# Altium schematic sheet energy_meter_blk - Copy.SchDoc
size A4; Date: 1/11/16; Engineer: JBayalas; DocumentNumber: 5; Revision: V5.0.0; SheetNumber: 5; SheetTotal: 13
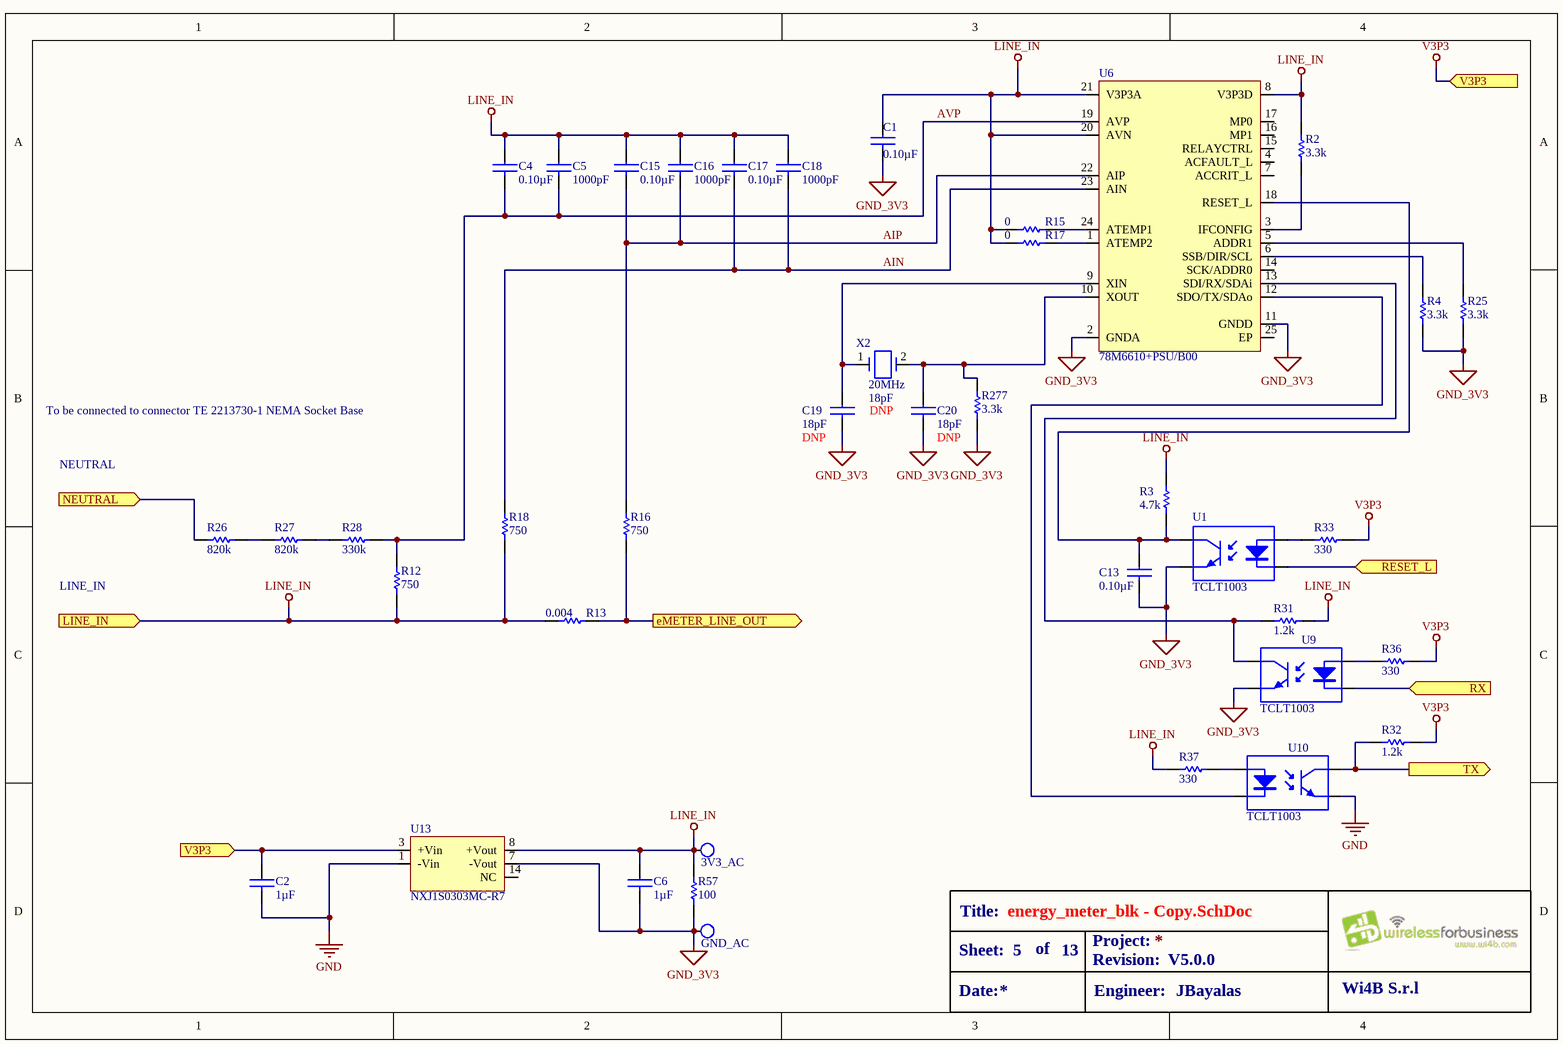
[diagram p0: energy_meter_blk - Copy.SchDoc]

## Parts
3V3_AC  TestPad TH  [TestPad TH]  (value not drawn)
C1  value 0.10µF  [C0402]  (hidden comment: GRM155R71H104ME14D)
C2  value 1µF  [C0603]  (hidden comment: GRM188R71C105KA12D)
C4  value 0.10µF  [C0402]  (hidden comment: GRM155R71H104ME14D)
C5  value 1000pF  [C0402]  (hidden comment: GRM1555C1H102JA01D)
C6  value 1µF  [C0603]  (hidden comment: GRM188R71C105KA12D)
C13  value 0.10µF  [C0402]  (hidden comment: GRM155R71H104ME14D)
C15  value 0.10µF  [C0402]  (hidden comment: GRM155R71H104ME14D)
C16  value 1000pF  [C0402]  (hidden comment: GRM1555C1H102JA01D)
C17  value 0.10µF  [C0402]  (hidden comment: GRM155R71H104ME14D)
C18  value 1000pF  [C0402]  (hidden comment: GRM1555C1H102JA01D)
C19  value 18pF  [C0402]  (hidden comment: GRM1555C1H180FA01D)
C20  value 18pF  [C0402]  (hidden comment: GRM1555C1H180FA01D)
GND_AC  TestPad TH  [TestPad TH]  (value not drawn)
R2  value 3.3k  [R0402]  (hidden comment: RC0402FR-073K3P)
R3  value 4.7k  [R0402]  (hidden comment: RC0402FR-074K7P)
R4  value 3.3k  [R0402]  (hidden comment: RC0402FR-073K3P)
R12  value 750  [R0603]  (hidden comment: RC0603FR-07750RL)
R13  value 0.004  [R2512]  (hidden comment: PA2512FKE7T0R004E)
R15  value 0  [R0603]  (hidden comment: RC0603FR-070RL)
R16  value 750  [R0603]  (hidden comment: RC0603FR-07750RL)
R17  value 0  [R0603]  (hidden comment: RC0603FR-070RL)
R18  value 750  [R0603]  (hidden comment: RC0603FR-07750RL)
R25  value 3.3k  [R0402]  (hidden comment: RC0402FR-073K3P)
R26  value 820k  [R1206]  (hidden comment: RC1206FR-07820KL)
R27  value 820k  [R1206]  (hidden comment: RC1206FR-07820KL)
R28  value 330k  [R1206]  (hidden comment: RC1206FR-07330KL)
R31  value 1.2k  [RESC1005X40N]  (hidden comment: RC0402FR-071K2L)
R32  value 1.2k  [RESC1005X40N]  (hidden comment: RC0402FR-071K2L)
R33  value 330  [R0402]  (hidden comment: RC0402FR-07330RL)
R36  value 330  [R0402]  (hidden comment: RC0402FR-07330RL)
R37  value 330  [R0402]  (hidden comment: RC0402FR-07330RL)
R57  value 100  [R1206]  (hidden comment: RC1206JR-07100RL)
R277  value 3.3k  [R0402]  (hidden comment: RC0402FR-073K3P)
U1  TCLT1003  [SOP-4L]
U6  78M6610+PSU/B00  [QFN-24 (4X4mm)]
U9  TCLT1003  [SOP-4L]
U10  TCLT1003  [SOP-4L]
U13  NXJ1S0303MC-R7  [NXJ1S0303MC-R7]
X2  Frequency: 20MHz  Load Capacitance: 18pF  [ABLS7M (crystal)]  (hidden comment: ABLS7M-20.000MHZ-B-2-T)

## Ports
eMETER_LINE_OUT (out), LINE_IN (in), NEUTRAL (in), RESET_L (in), RX (in), TX (out), V3P3 (in)

## Nets
GND: C2.2 U10.3(A/K) U13.1(-Vin)
GND_3V3: C1.2 C6.2 C13.2 C19.2 C20.2 GND_AC.1 R4.1 R25.1 R57.1 R277.1 U1.3(A/K) U6.2(GNDA) U6.11(GNDD) U9.3(A/K) U13.7(-Vout)
LINE_IN: 3V3_AC.1 C1.1 C4.1 C5.1 C6.1 C15.1 C16.1 C17.1 C18.1 R2.2 R3.2 R12.1 R13.1 R15.1 R17.1 R18.1 R31.2 R37.1 R57.2 U6.8(V3P3D) U6.20(AVN) U6.21(V3P3A) U13.8(+Vout) ; port LINE_IN
V3P3: C2.1 R32.2 R33.2 R36.2 U13.3(+Vin) ; port V3P3
AIN: C17.2 C18.2 R18.2 U6.23(AIN)
AIP: C15.2 C16.2 R16.2 U6.22(AIP)
AVP: C4.2 C5.2 R12.2 R28.2 U6.19(AVP)
eMETER_LINE_OUT: R13.2 R16.1 ; port eMETER_LINE_OUT
NEUTRAL: R26.1 ; port NEUTRAL
RESET_L: U1.2(K) ; port RESET_L
RX: U9.2(K) ; port RX
TX: R32.1 U10.4(A/K) ; port TX
NetC13_1: C13.1 R3.1 U1.4(A/K) U6.18(RESET_L)
NetC19_1: C19.1 U6.9(XIN) X2.1
NetC20_1: C20.1 R277.2 U6.10(XOUT) X2.2
NetR2_1: R2.1 U6.3(IFCONFIG)
NetR4_2: R4.2 U6.6(SSB/DIR/SCL)
NetR15_2: R15.2 U6.24(ATEMP1)
NetR17_2: R17.2 U6.1(ATEMP2)
NetR25_2: R25.2 U6.5(ADDR1)
NetR26_2: R26.2 R27.1
NetR27_2: R27.2 R28.1
NetR31_1: R31.1 U6.13(SDI/RX/SDAi) U9.4(A/K)
NetR33_1: R33.1 U1.1(A)
NetR36_1: R36.1 U9.1(A)
NetR37_2: R37.2 U10.1(A)
NetU6_12: U6.12(SDO/TX/SDAo) U10.2(K)

Not connected (* = marked no-connect by the designer): U6 4(ACFAULT_L) 7(ACCRIT_L) 14(SCK/ADDR0) 15(RELAYCTRL) 16(MP1) 17(MP0) 25(EP); U13 14(NC)

## Notes on the sheet
- To be connected to connector TE 2213730-1 NEMA Socket Base
- NEUTRAL
- LINE_IN
- Title:
- Sheet:
- Date:
- of
- Project:
- Revision:
- Engineer:
- Wi4B S.r.l

## Library data of the parts
3V3_AC GND_AC = TestPad TH: FUNCTION: eMETER
C1 C4 C13 C15 C17 = GRM155R71H104ME14D: CAP CER 0.1UF 50V X7R 0402; MFT: Murata Electronics North America; TYPE: SMD; FUNCTION: eMETER; MPN: GRM155R71H104ME14D; RATING: 50V; DNP: *
C2 C6 = GRM188R71C105KA12D: CAP CER 1UF 16V X7R 0603; MFT: Murata Electronics North America; RATING: ±10%, 16V; TYPE: Surface Mount, MLCC; FUNCTION: eMETER; MPN: GRM188R71C105KA12D
C5 C16 C18 = GRM1555C1H102JA01D: CAP CER 1000PF 50V NP0 0402; MFT: Murata Electronics North America; TYPE: SMD; FUNCTION: eMETER; MPN: GRM1555C1H102JA01D; RATING: 50V; DNP: *
C19 C20 = GRM1555C1H180FA01D: CAP CER 18PF 50V NP0 0402; MFT: Murata Electronics North America; TYPE: SMD; FUNCTION: eMETER; MPN: GRM1555C1H180FA01D; RATING: 50V; DNP: DNP
R2 R4 R25 R277 = RC0402FR-073K3P: RES SMD 3.3K OHM 1% 1/16W 0402; MFT: YAGEO; FUNCTION: eMETER; MPN: RC0402FR-073K3P; TYPE: SMD; RATING: 1/16W; LOAD: *; APN: *
R3 = RC0402FR-074K7P: RES SMD 4.7K OHM 1% 1/16W 0402; MFT: YAGEO; FUNCTION: eMETER; MPN: RC0402FR-074K7P; RATING: 1/16W; LOAD: *; TYPE: SMD; APN: *
R12 R16 R18 = RC0603FR-07750RL: RES 750 OHM 1% 1/10W 0603; MFT: YAGEO; FUNCTION: eMETER; MPN: RC0603FR-07750RL; TYPE: SMD; RATING: 1/10W; LOAD: *; APN: *
R13 = PA2512FKE7T0R004E: RES 0.004 OHM 1% 3W 2512; MFT: YAGEO; FUNCTION: eMETER; MPN: PA2512FKE7T0R004E; TYPE: SMD; LOAD: *; RATING: 3W; APN: *
R15 R17 = RC0603FR-070RL: RES 0 OHM JUMPER 1/10W 0603; MFT: YAGEO; FUNCTION: eMETER; MPN: RC0603FR-070RL; RATING: *; TYPE: SMD; LOAD: *; APN: *
R26 R27 = RC1206FR-07820KL: RES 820K OHM 1% 1/4W 1206; MFT: YAGEO; FUNCTION: eMETER; MPN: RC1206FR-07820KL; TYPE: SMD; RATING: 1/4W; LOAD: *; APN: *
R28 = RC1206FR-07330KL: RES 330K OHM 1% 1/4W 1206; MFT: YAGEO; FUNCTION: eMETER; MPN: RC1206FR-07330KL; TYPE: SMD; RATING: 1/4W; LOAD: *; APN: *
R31 R32 = RC0402FR-071K2L: RES SMD 1.2K OHM 1% 1/16W 0402; MFT: Yageo; APN: RQ-0122-R7-C; FUNCTION: eMETER; MPN: RC0402FR-071K2L; TYPE: SMD; RATING: 1/16W; LOAD: *
R33 R36 R37 = RC0402FR-07330RL: RES SMD 330 OHM 1% 1/16W 0402; MFT: Yageo; FUNCTION: eMETER; MPN: RC0402FR-07330RL; TYPE: SMD; RATING: 1/16W; LOAD: *
R57 = RC1206JR-07100RL: RES 100 OHM 5% 1/4W 1206; MFT: YAGEO; FUNCTION: eMETER; MPN: RC1206JR-07100RL; LOAD: *; RATING: 1/4W; TYPE: SMD; APN: *
U1 U9 U10 = TCLT1003: OPTOISOLATR 5KV TRANSISTOR 4-SOP; ALT MPN1: LTV1003-TP-V-G; MFT: Vishay Semiconductor Opto Division; ALT DESC1: Photocoupler; ALT MFT1: LITEON; FUNCTION: eMETER; VALUE: TCLT1003; TYPE: SMD; RATING: 5KV; MPN: TCLT1003; LOAD: *
U6 = 78M6610+PSU/B00: IC ENERGY MEASURMENT 1PH 24TQFN; Manufacturer: Maxim Integrated; Input Impedance: 30 kOhm ~ 90 kOhm; Voltage - I/O High: 0.6V, 2V; Voltage - I/O Low: 0.5V, 0.8V; Current - Supply: 8.1mA; Voltage - Supply: 3 V ~ 3.6 V; Meter Type: Single Phase; FUNCTION: eMETER; Supplier 1: Digi-Key; RoHS: RoHS non-compliant; Category: Integrated Circuits (ICs); Stock 1: 62; Pricing 1: 1=2.56, 10=2.432, 25=2.3, 50=2.185, 100=2.15, 250=2.04248, 1000=1.93392 (USD); Packaging: Tube; Measurement Error: -; Operating Temperature: -40°C ~ 85°C; Mounting Type: Surface Mount; Package / Case: 24-WFQFN Exposed Pad; Supplier Device Package: 24-TQFN (4x4); ComponentLink1URL: http://datasheets.maximintegrated.com/en/ds/78M6610+PSU.pdf; ComponentLink1Description: http://datasheets.maximintegrated.com/en/ds/78M6610+PSU.pdf; Supplier Part Number 1: 78M6610+PSU/B00-ND; Manufacturer Part Number: 78M6610+PSU/B00
U13 = NXJ1S0303MC-R7: Isolated DC/DC Converters 1W 3.3Vin 3.3Vout 333mA SM; ALT MPN1: NXE1S0303MC-R7; ALT MPN2: F0303XT-1WR2; MFT: Murata Power Solutions; ALT DESC1: DC DC CONVERTER 3.3V 1W; ALT DESC2: 1W isolated DC-DC converter, Fixed input voltage, unregulated single output; ALT MFT1: Murata Power Solutions Inc.; ALT MFT2: Mornsun; FUNCTION: eMETER; TYPE: SMD/SMT; VALUE: NXJ1S0303MC-R7; MPN: NXJ1S0303MC-R7
X2 = ABLS7M-20.000MHZ-B-2-T: CRYSTAL 20.000 MHZ 18PF SMT; Manufacturer: Abracon LLC; Frequency Stability: ±50ppm; Frequency Tolerance: ±20ppm; ESR (Equivalent Series Resistance): 40 Ohm; Operating Mode: Fundamental; FUNCTION: eMETER; Supplier 1: Digi-Key; Manufacturer Part Number: ABLS7M-20.000MHZ-B-2-T; RoHS: RoHS Compliant; Category: Crystals and Oscillators; Stock 1: 0; Pricing 1: 3000=0.1725 (USD); Packaging: Tape & Reel (TR); Type: MHz Crystal; Operating Temperature: -20°C ~ 70°C; Ratings: -; Mounting Type: Surface Mount; Package / Case: 2-SMD; Size / Dimension: 0.450" L x 0.190" W (11.40mm x 4.70mm); Height: 0.165" (4.20mm); ComponentLink1URL: http://abracon.com/Resonators/ABLS7M.pdf; ComponentLink1Description: http://abracon.com/Resonators/ABLS7M.pdf; Supplier Part Number 1: ABLS7M-20.000MHZ-B-2-T-ND; DNP: DNP